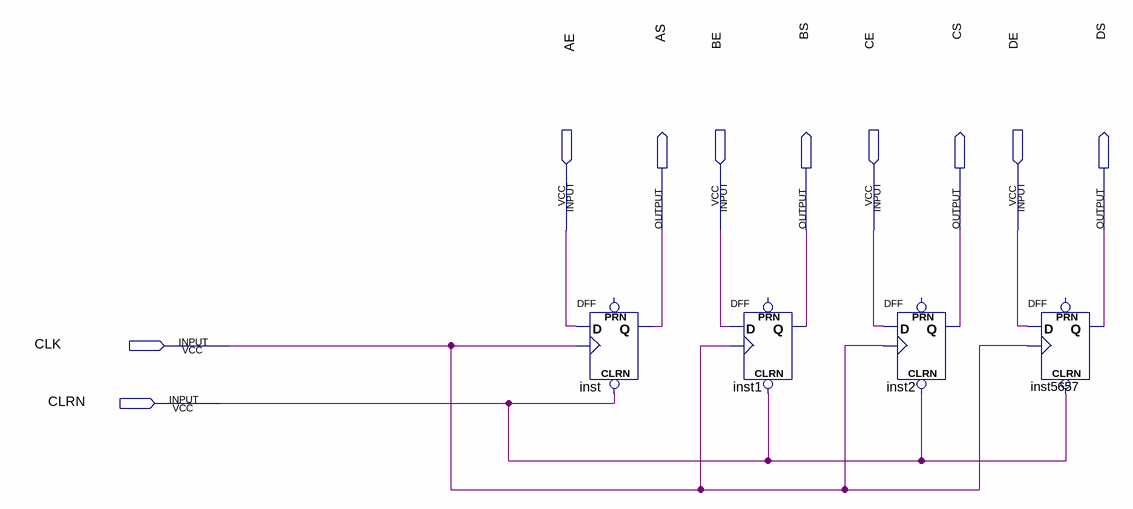
[diagram p0: schematic sheet]
// Quartus schematic RegPP.bdf as structural Verilog: 4 symbols, 10 pins
module RegPP (
  input  AE,
  input  BE,
  input  CE,
  input  DE,
  input  CLK,
  input  CLRN,
  output AS,
  output BS,
  output CS,
  output DS
);

  DFF inst (.CLRN(CLRN), .CLK(CLK), .D(AE), .Q(AS));  // open: PRN
  DFF inst1 (.CLRN(CLRN), .CLK(CLK), .D(BE), .Q(BS));  // open: PRN
  DFF inst2 (.CLRN(CLRN), .CLK(CLK), .D(CE), .Q(CS));  // open: PRN
  DFF inst5657 (.CLRN(CLRN), .CLK(CLK), .D(DE), .Q(DS));  // open: PRN
endmodule
